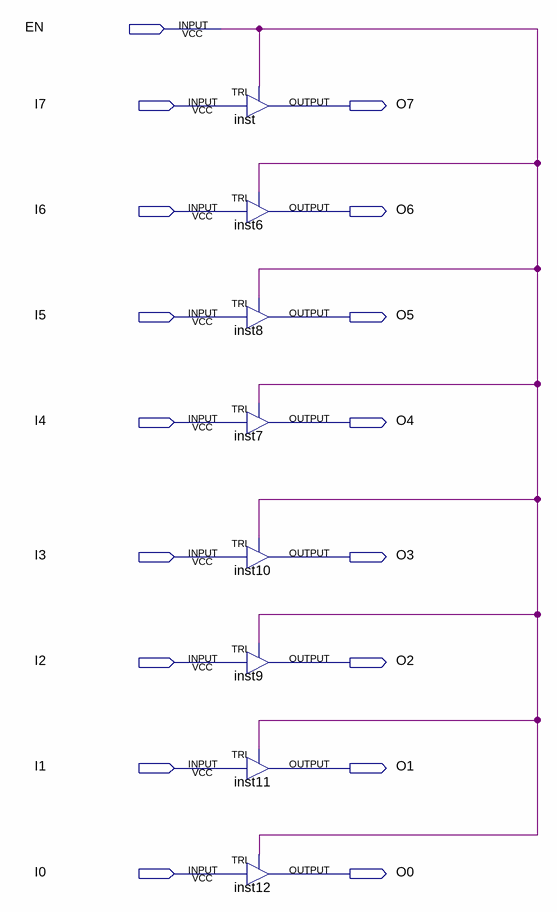
[diagram p0: schematic sheet]
// Quartus schematic tri_state_gate_8.bdf as structural Verilog: 8 symbols, 17 pins
module tri_state_gate_8 (
  input  EN,
  input  I7,
  input  I6,
  input  I5,
  input  I4,
  input  I3,
  input  I2,
  input  I1,
  input  I0,
  output O7,
  output O6,
  output O5,
  output O4,
  output O3,
  output O2,
  output O1,
  output O0
);

  TRI inst (.IN(I7), .OE(EN), .OUT(O7));
  TRI inst6 (.IN(I6), .OE(EN), .OUT(O6));
  TRI inst8 (.IN(I5), .OE(EN), .OUT(O5));
  TRI inst7 (.IN(I4), .OE(EN), .OUT(O4));
  TRI inst10 (.IN(I3), .OE(EN), .OUT(O3));
  TRI inst9 (.IN(I2), .OE(EN), .OUT(O2));
  TRI inst11 (.IN(I1), .OE(EN), .OUT(O1));
  TRI inst12 (.IN(I0), .OE(EN), .OUT(O0));
endmodule
